# Altium schematic sheet driver.SchDoc
size A4; DocumentNumber: 2; SheetNumber: 3
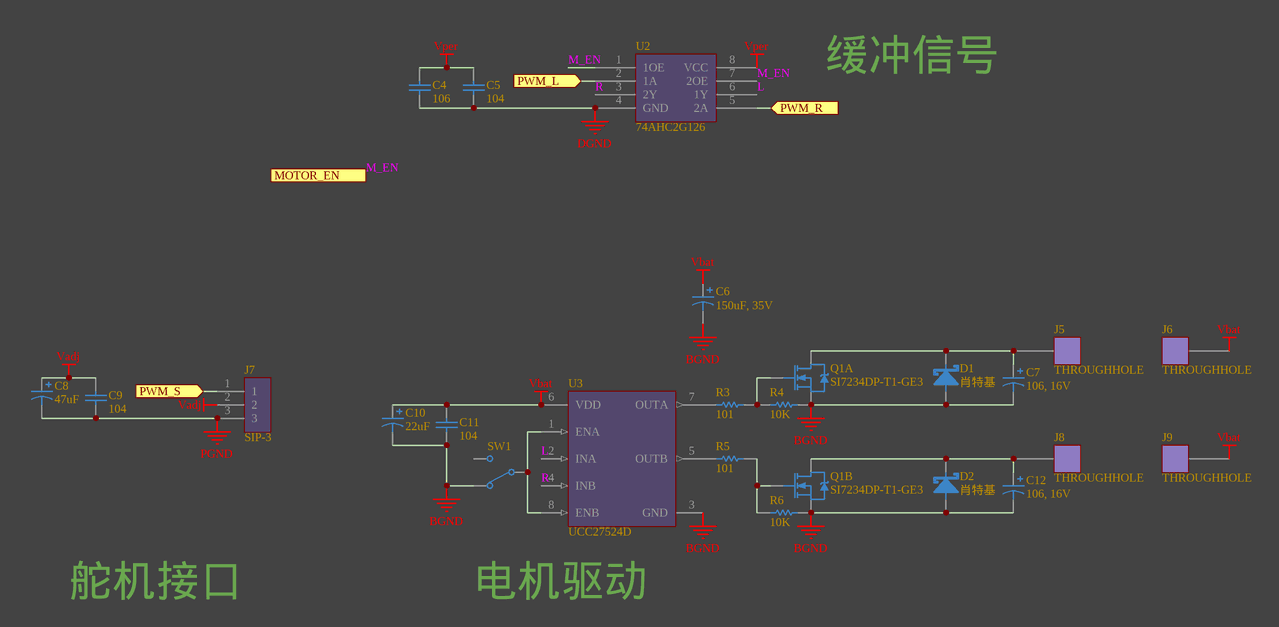
[diagram p0: driver.SchDoc]

## Parts
C4  106  [C0603]
C5  104  [C0402]
C6  150uF, 35V  [贴片电解 10*10.5]
C7  106, 16V  [贴片电解 6.3*5.4]
C8  47uF  [贴片电解 6.3*5.4]
C9  104  [C0402]
C10  22uF  [贴片电解 4*5.4]
C11  104  [C0402]
C12  106, 16V  [贴片电解 6.3*5.4]
D1  肖特基  [SOD-123F]
D2  肖特基  [SOD-123F]
J5  THROUGHHOLE  [MOTOR]
J6  THROUGHHOLE  [MOTOR]
J7  SIP-3  [2.54排针1X3]
J8  THROUGHHOLE  [MOTOR]
J9  THROUGHHOLE  [MOTOR]
Q1  SI7234DP-T1-GE3  [DFN-8EP2]  (parts A,B of 2)
R3  101  [R0603]
R4  10K  [R0402]
R5  101  [R0603]
R6  10K  [R0402]
SW1  K3-1235S-K1  [K3-1235S-K1]  (value not drawn)
U2  74AHC2G126  [VSSOP-8]
U3  UCC27524D  [TSSOP-8EP]

## Ports
MOTOR_EN (in), PWM_L (in), PWM_R (in), PWM_S (in)

## Nets
BGND: C6.2 C7.2 C10.2 C11.1 C12.2 D1.1(A) D2.1(A) Q1.1(S) Q1.3(S) R4.1 R6.1 SW1.1 U3.3(GND)
DGND: C4.1 C5.1 U2.4(GND)
PGND: C8.2 C9.1 J7.3
Vadj: C8.1 C9.2 J7.2
Vbat: C6.1 C10.1 C11.2 J6.1 J9.1 U3.6(VDD)
Vper: C4.2 C5.2 U2.8(VCC)
L: U2.6(1Y) U3.2(INA)
M_EN: U2.1(1OE) U2.7(2OE) ; port MOTOR_EN
PWM_L: U2.2(1A) ; port PWM_L
PWM_R: U2.5(2A) ; port PWM_R
PWM_S: J7.1 ; port PWM_S
R: U2.3(2Y) U3.4(INB)
NetC7_1: C7.1 D1.2(K) J5.1 Q1.6(D)
NetC12_1: C12.1 D2.2(K) J8.1 Q1.5(D)
NetQ1_2: Q1.2(G) R3.1 R4.2
NetQ1_4: Q1.4(G) R5.1 R6.2
NetR3_2: R3.2 U3.7(OUTA)
NetR5_2: R5.2 U3.5(OUTB)
NetSW1_2: SW1.2 U3.1(ENA) U3.8(ENB)

Not connected (* = marked no-connect by the designer): SW1 3

## Notes on the sheet
- 缓冲信号
- 舵机接口
- 电机驱动

## Library data of the parts
C4 C5 C9 C11 = 电容: Capacitor; Value: 22pF; Published: 8-Jun-2000; LatestRevisionDate: 17-Jul-2002; LatestRevisionNote: Re-released for DXP Platform.; PackageReference: RAD-0.3; Publisher: Altium Limited; PackageDescription: Radial Cap, Thru-Hole; 2 Leads; 0.3 in Pin Spacing
C6-C8 C10 C12 = 电解电容: Polarized Capacitor (Axial); Value: 100pF; Published: 8-Jun-2000; LatestRevisionDate: 17-Jul-2002; LatestRevisionNote: Re-released for DXP Platform.; PackageReference: POLAR0.8; Publisher: Altium Limited; PackageDescription: Polarized Capacitor; 2 Leads
D1 D2 = 肖特基: Schottky Diode
J5 J6 J8 J9 = MOTOR
Q1 = N沟道MOSFET: CQ-BS170
R3-R6 = 电阻: Resistor; Value: 150R; Published: 8-Jun-2000; LatestRevisionDate: 17-Jul-2002; LatestRevisionNote: Re-released for DXP Platform.; PackageReference: AXIAL-0.3; Publisher: Altium Limited; PackageDescription: Axial Device, Thru-Hole; 2 Leads; 0.3 in Pin Spacing
SW1 = 单刀双掷: Switch
U2 = 74126
U3 = UCC27524D: No Description Available; PartNumber: UCC27524DR; Manufacturer: Texas Instruments; RefDes: RefDes; Type: DEV; Value: Value; Copyright: Copyright (C) 2018 Accelerated Designs. All rights reserved